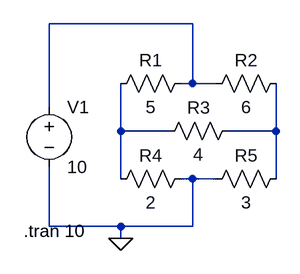
[diagram p0: schematic Draft1.asc]
Draft1.asc, the LTspice schematic file:
Version 4
SHEET 1 880 680
WIRE 352 -16 160 -16
WIRE 352 64 352 -16
WIRE 352 64 336 64
WIRE 384 64 352 64
WIRE 160 96 160 -16
WIRE 256 128 256 64
WIRE 320 128 256 128
WIRE 464 128 464 64
WIRE 464 128 400 128
WIRE 256 192 256 128
WIRE 352 192 336 192
WIRE 384 192 352 192
WIRE 464 192 464 128
WIRE 160 256 160 176
WIRE 256 256 160 256
WIRE 352 256 352 192
WIRE 352 256 256 256
WIRE 256 272 256 256
FLAG 256 272 0
SYMBOL voltage 160 80 R0
WINDOW 123 0 0 Left 0
WINDOW 39 0 0 Left 0
SYMATTR InstName V1
SYMATTR Value 10
SYMBOL res 352 48 R90
WINDOW 0 0 56 VBottom 2
WINDOW 3 32 56 VTop 2
SYMATTR InstName R1
SYMATTR Value 5
SYMBOL res 480 48 R90
WINDOW 0 0 56 VBottom 2
WINDOW 3 32 56 VTop 2
SYMATTR InstName R2
SYMATTR Value 6
SYMBOL res 416 112 R90
WINDOW 0 0 56 VBottom 2
WINDOW 3 32 56 VTop 2
SYMATTR InstName R3
SYMATTR Value 4
SYMBOL res 352 176 R90
WINDOW 0 0 56 VBottom 2
WINDOW 3 32 56 VTop 2
SYMATTR InstName R4
SYMATTR Value 2
SYMBOL res 480 176 R90
WINDOW 0 0 56 VBottom 2
WINDOW 3 32 56 VTop 2
SYMATTR InstName R5
SYMATTR Value 3
TEXT 126 262 Left 2 !.tran 10

The netlist it stands for:
* Draft1.asc
V1 N001 0 10
R1 N001 N002 5
R2 N003 N001 6
R3 N003 N002 4
R4 0 N002 2
R5 N003 0 3
.tran 10
.backanno
.end